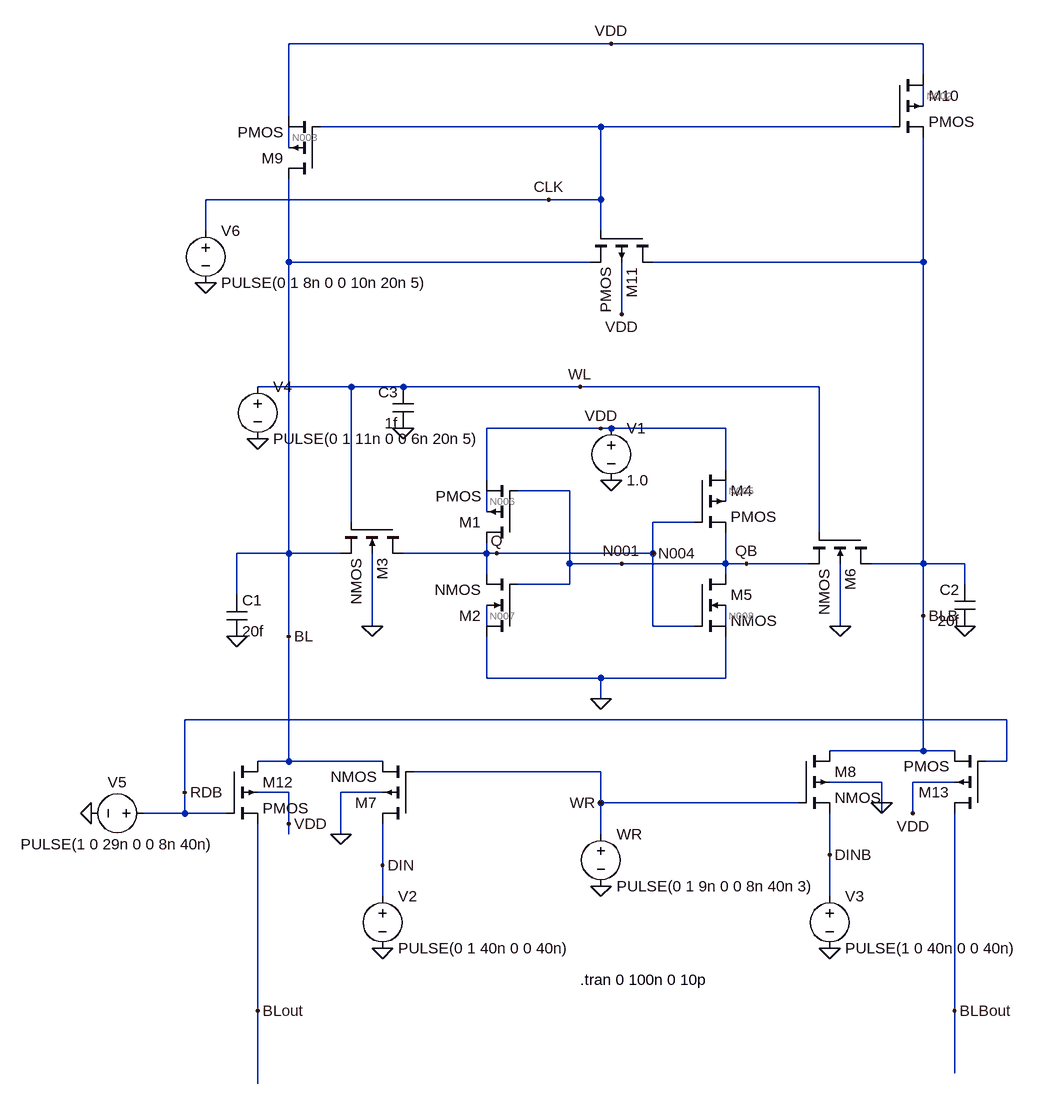
[diagram p0: schematic 6Tcell_working.asc]
6Tcell_working.asc, the LTspice schematic file:
Version 4
SHEET 1 880 964
WIRE -304 -640 -800 -640
WIRE 176 -640 -304 -640
WIRE 176 -592 176 -640
WIRE 176 -544 176 -576
WIRE -800 -528 -800 -640
WIRE -320 -512 -752 -512
WIRE 128 -512 -320 -512
WIRE -800 -480 -800 -512
WIRE -400 -400 -928 -400
WIRE -320 -400 -320 -512
WIRE -320 -400 -400 -400
WIRE -928 -352 -928 -400
WIRE -320 -352 -320 -400
WIRE -800 -304 -800 -432
WIRE -336 -304 -800 -304
WIRE 176 -304 176 -496
WIRE 176 -304 -240 -304
WIRE -288 -224 -288 -304
WIRE -704 -112 -848 -112
WIRE -624 -112 -704 -112
WIRE -352 -112 -624 -112
WIRE 16 -112 -352 -112
WIRE -320 -48 -496 -48
WIRE -304 -48 -320 -48
WIRE -128 -48 -304 -48
WIRE -128 16 -128 -48
WIRE -496 32 -496 -48
WIRE -368 48 -448 48
WIRE -128 64 -128 32
WIRE -496 80 -496 48
WIRE -704 96 -704 -112
WIRE -176 96 -240 96
WIRE 16 112 16 -112
WIRE -800 144 -800 -304
WIRE -800 144 -880 144
WIRE -720 144 -800 144
WIRE -496 144 -496 128
WIRE -496 144 -624 144
WIRE -480 144 -496 144
WIRE -240 144 -240 96
WIRE -240 144 -480 144
WIRE -368 160 -368 48
WIRE -288 160 -368 160
WIRE -128 160 -128 112
WIRE -128 160 -288 160
WIRE -96 160 -128 160
WIRE 0 160 -96 160
WIRE 176 160 176 -304
WIRE 176 160 96 160
WIRE 240 160 176 160
WIRE -496 176 -496 144
WIRE -128 176 -128 160
WIRE -368 192 -368 160
WIRE -368 192 -448 192
WIRE 240 192 240 160
WIRE -880 208 -880 144
WIRE 176 240 176 160
WIRE -672 256 -672 144
WIRE -496 256 -496 224
WIRE -240 256 -240 144
WIRE -176 256 -240 256
WIRE -128 256 -128 224
WIRE 48 256 48 160
WIRE -800 272 -800 144
WIRE -496 336 -496 272
WIRE -320 336 -496 336
WIRE -128 336 -128 272
WIRE -128 336 -320 336
WIRE -320 368 -320 336
WIRE 304 400 -960 400
WIRE 176 448 176 240
WIRE 176 448 32 448
WIRE 224 448 176 448
WIRE -800 464 -800 272
WIRE -800 464 -848 464
WIRE -656 464 -800 464
WIRE 304 464 304 400
WIRE 304 464 272 464
WIRE -320 480 -608 480
WIRE 112 496 32 496
WIRE 224 496 160 496
WIRE -960 512 -960 400
WIRE -800 512 -848 512
WIRE -656 512 -720 512
WIRE -320 528 -320 480
WIRE -16 528 -320 528
WIRE 112 528 112 496
WIRE -960 544 -960 512
WIRE -960 544 -1024 544
WIRE -896 544 -960 544
WIRE 112 544 112 528
WIRE 160 544 160 496
WIRE -800 560 -800 512
WIRE -800 576 -800 560
WIRE -720 576 -720 512
WIRE -320 576 -320 528
WIRE 32 608 32 544
WIRE -656 624 -656 560
WIRE -656 672 -656 624
WIRE 32 672 32 608
WIRE -848 848 -848 560
WIRE 224 848 224 544
WIRE 224 944 224 848
WIRE -848 960 -848 848
FLAG -320 -48 VDD
FLAG -320 368 0
FLAG -304 32 0
FLAG -800 272 BL
FLAG 176 240 BLB
FLAG -672 256 0
FLAG 48 256 0
FLAG -240 144 N004
FLAG -288 160 N001
FLAG -480 144 Q
FLAG -96 160 QB
FLAG -880 272 0
FLAG 240 256 0
FLAG -352 -112 WL
FLAG -848 -32 0
FLAG -624 -48 0
FLAG -656 752 0
FLAG 32 752 0
FLAG -320 656 0
FLAG -320 528 WR
FLAG -656 624 DIN
FLAG 32 608 DINB
FLAG -928 -272 0
FLAG -304 -640 VDD
FLAG -288 -224 VDD
FLAG -400 -400 CLK
FLAG -848 848 BLout
FLAG 224 848 BLBout
FLAG -960 512 RDB
FLAG -1104 544 0
FLAG -800 560 VDD
FLAG -720 576 0
FLAG 112 528 0
FLAG 160 544 VDD
SYMBOL nmos4 -624 96 R90
SYMATTR InstName M3
SYMATTR Value2 l=65n w=130n
SYMBOL voltage -304 -64 R0
SYMATTR InstName V1
SYMATTR Value 1.0
SYMBOL pmos4 -448 128 R180
SYMATTR InstName M1
SYMATTR Value2 l=65n w=200n
SYMBOL nmos4 -448 272 R180
SYMATTR InstName M2
SYMATTR Value2 l=65n w=180n
SYMBOL nmos4 -176 176 R0
SYMATTR InstName M5
SYMATTR Value2 l=65n w=180n
SYMBOL nmos4 96 112 R90
SYMATTR InstName M6
SYMATTR Value2 l=65n w=130n
SYMBOL pmos4 -176 16 R0
SYMATTR InstName M4
SYMATTR Value2 l=65n w=200n
SYMBOL cap -896 208 R0
SYMATTR InstName C1
SYMATTR Value 20f
SYMBOL cap 256 256 R180
WINDOW 0 24 56 Left 2
WINDOW 3 24 8 Left 2
SYMATTR InstName C2
SYMATTR Value 20f
SYMBOL cap -608 -48 R180
WINDOW 0 24 56 Left 2
WINDOW 3 24 8 Left 2
SYMATTR InstName C3
SYMATTR Value 1f
SYMBOL voltage -656 656 R0
SYMATTR InstName V2
SYMATTR Value PULSE(0 1 40n 0 0 40n)
SYMBOL voltage 32 656 R0
SYMATTR InstName V3
SYMATTR Value PULSE(1 0 40n 0 0 40n)
SYMBOL voltage -848 -128 R0
SYMATTR InstName V4
SYMATTR Value PULSE(0 1 11n 0 0 6n 20n 5)
SYMBOL voltage -320 560 R0
SYMATTR InstName WR
SYMATTR Value PULSE(0 1 9n 0 0 8n 40n 3)
SYMBOL pmos4 128 -592 R0
SYMATTR InstName M10
SYMATTR Value2 l=65n w=500n
SYMBOL pmos4 -752 -432 R180
SYMATTR InstName M9
SYMATTR Value2 l=65n w=500n
SYMBOL pmos4 -240 -352 R90
SYMATTR InstName M11
SYMATTR Value2 l=65n w=500n
SYMBOL voltage -928 -368 R0
SYMATTR InstName V6
SYMATTR Value PULSE(0 1 8n 0 0 10n 20n 5)
SYMBOL pmos4 -608 560 R180
SYMATTR InstName M7
SYMATTR Value2 l=65n w=500n
SYMATTR Value NMOS
SYMBOL pmos4 -16 448 R0
SYMATTR InstName M8
SYMATTR Value2 l=65n w=500n
SYMATTR Value NMOS
SYMBOL pmos4 -896 464 R0
SYMATTR InstName M12
SYMATTR Value2 l=65n w=500n
SYMBOL pmos4 272 544 R180
SYMATTR InstName M13
SYMATTR Value2 l=65n w=500n
SYMBOL voltage -1008 544 R90
WINDOW 0 -32 56 VBottom 2
WINDOW 3 32 56 VTop 2
SYMATTR InstName V5
SYMATTR Value PULSE(1 0 29n 0 0 8n 40n)
TEXT -352 800 Left 2 !.tran 0 100n 0 10p

The netlist it stands for:
* 6Tcell_working.asc
M3 Q WL BL 0 NMOS l=65n w=130n
V1 VDD 0 1.0
M1 Q QB VDD N006 PMOS l=65n w=200n
M2 0 QB Q N007 NMOS l=65n w=180n
M5 QB Q 0 N008 NMOS l=65n w=180n
M6 BLB WL QB 0 NMOS l=65n w=130n
M4 VDD Q QB N005 PMOS l=65n w=200n
C1 BL 0 20f
C2 0 BLB 20f
C3 0 WL 1f
V2 DIN 0 PULSE(0 1 40n 0 0 40n)
V3 DINB 0 PULSE(1 0 40n 0 0 40n)
V4 WL 0 PULSE(0 1 11n 0 0 6n 20n 5)
V§WR WR 0 PULSE(0 1 9n 0 0 8n 40n 3)
M10 VDD CLK BLB N002 PMOS l=65n w=500n
M9 BL CLK VDD N003 PMOS l=65n w=500n
M11 BLB CLK BL VDD PMOS l=65n w=500n
V6 CLK 0 PULSE(0 1 8n 0 0 10n 20n 5)
M7 DIN WR BL 0 NMOS l=65n w=500n
M8 BLB WR DINB 0 NMOS l=65n w=500n
M12 BL RDB BLout VDD PMOS l=65n w=500n
M13 BLBout RDB BLB VDD PMOS l=65n w=500n
V5 RDB 0 PULSE(1 0 29n 0 0 8n 40n)
.model NMOS NMOS
.model PMOS PMOS
.lib standard.mos
.tran 0 100n 0 10p
.backanno
.end

* Results of the author's LTspice run, read from the files saved beside the schematic
* Operating Point, zero values left out:
*   V(q) = 513.2 mV
*   V(bl) = 1 V
*   V(vdd) = 1 V
*   V(qb) = 513.2 mV
*   V(n006) = 877.5 mV
*   V(n007) = 85.79 mV
*   V(n008) = 85.79 mV
*   V(blb) = 1 V
*   V(n005) = 877.5 mV
*   V(dinb) = 1 V
*   V(n002) = 906.6 mV
*   V(n003) = 906.6 mV
*   V(rdb) = 1 V
*   V(blout) = 1.001 V
*   V(blbout) = 1 V
*   Id(M13) = 7.077 pA
*   Is(M13) = -7.077 pA
*   Id(M12) = -40.11 pA
*   Is(M12) = 40.11 pA
*   Id(M9) = -3.174 pA
*   Is(M9) = 4.081 pA
*   Id(M10) = 3.747 pA
*   Is(M10) = -2.841 pA
*   Id(M4) = 7.293 µA
*   Is(M4) = -7.293 µA
*   Id(M1) = -7.293 µA
*   Is(M1) = 7.293 µA
*   Id(M8) = 1.01 pA
*   Ib(M8) = -2.02 pA
*   Is(M8) = 1.01 pA
*   Ib(M7) = -1.01 pA
*   Is(M7) = 2.01 pA
*   Id(M6) = 1.497 pA
*   Ib(M6) = -1.533 pA
*   Id(M5) = 7.293 µA
*   Is(M5) = -7.293 µA
*   Id(M2) = -7.293 µA
*   Is(M2) = 7.293 µA
*   Ib(M3) = -1.533 pA
*   Is(M3) = 1.497 pA
*   I(V3) = -1.01 pA
*   I(V1) = -14.59 µA
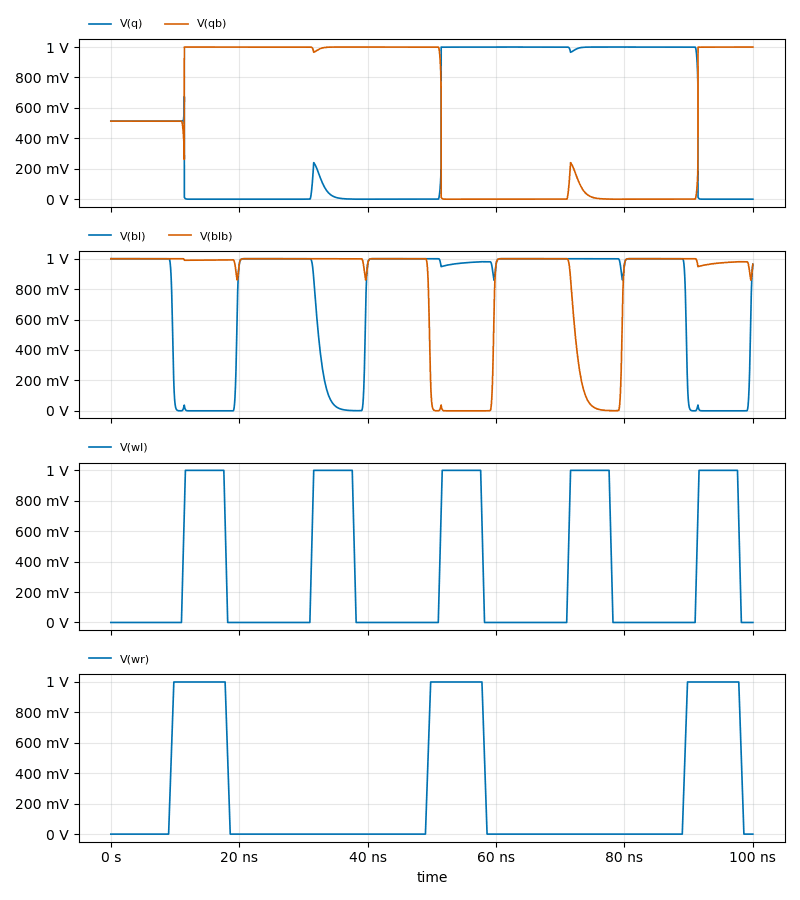
[diagram p1: Transient Analysis of 6Tcell_working.asc, plotted from the saved traces]
* Transient Analysis, 1 run:
*   V(q): min -214 nV, max 1 V, average 462.4 mV, rms 655.4 mV, last 0 V
*   V(qb): min -214 nV, max 1 V, average 547.6 mV, rms 717.5 mV, last 1 V
*   V(bl): min -665.9 nV, max 1 V, average 726.5 mV, rms 843.6 mV, last 962.7 mV
*   V(blb): min -665.9 nV, max 1 V, average 824.8 mV, rms 900.6 mV, last 963.7 mV
*   V(wl): min 0 V, max 1 V, average 330 mV, rms 566.6 mV, last 0 V
*   V(wr): min 0 V, max 1 V, average 264 mV, rms 506.9 mV, last 0 V